# Altium schematic sheet Sheet1.SchDoc
size A4
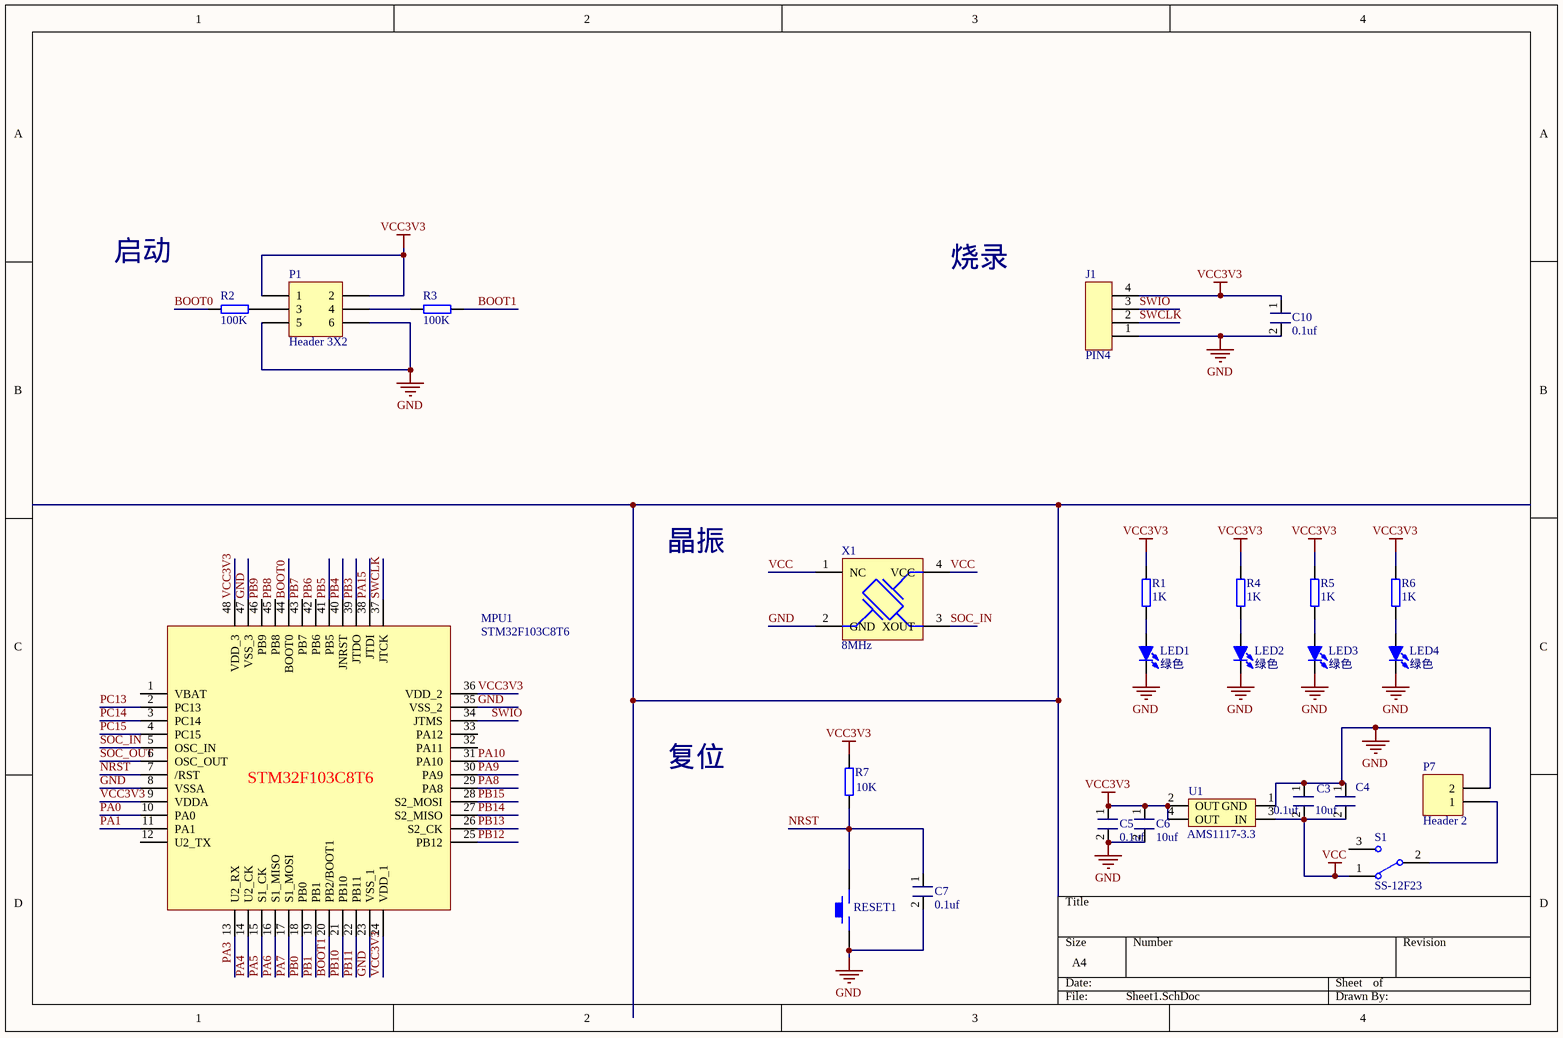
[diagram p0: Sheet1.SchDoc]

## Parts
C3  0.1uf  [0603-C]
C4  10uf  [0603-C]
C5  0.1uf  [0603-C]
C6  10uf  [0603-C]
C7  0.1uf  [0603-C]
C10  0.1uf  [0603-C]
J1  PIN4  [HDR-1X4_H]
LED1  绿色  [LED 0603W]
LED2  绿色  [LED 0603W]
LED3  绿色  [LED 0603W]
LED4  绿色  [LED 0603W]
MPU1  STM32F103C8T6  [stm32f103c8t6]
P1  Header 3X2  [HDR2X3]
P7  Header 2  [TX60PW-F20]
R1  1K  [0603-R]
R2  100K  [0603-R]
R3  100K  [0603-R]
R4  1K  [0603-R]
R5  1K  [0603-R]
R6  1K  [0603-R]
R7  10K  [0603-R]
RESET1  KEY_M  [TSW SMD-6*6*11]  (value not drawn)
S1  SS-12F23  [SS-12D10]
U1  AMS1117-3.3  [AMS1117]
X1  8MHz

## Nets
GND: C3.1 C4.1 C5.2 C6.2 C7.2 C10.2 J1.1 LED1.2(K) LED2.2(K) LED3.2(K) LED4.2(K) MPU1.8(VSSA) MPU1.23(VSS_1) MPU1.35(VSS_2) MPU1.47(VSS_3) P1.5 P1.6 P7.2 RESET1.1 U1.1(GND) X1.2(GND)
VCC: C3.2 C4.2 S1.1 U1.3(IN) X1.1(NC) X1.4(VCC)
VCC3V3: C5.1 C6.1 C10.1 J1.4 MPU1.9(VDDA) MPU1.24(VDD_1) MPU1.36(VDD_2) MPU1.48(VDD_3) P1.1 P1.2 R1.1 R4.1 R5.1 R6.1 R7.2 U1.2(OUT) U1.4(OUT)
BOOT0: MPU1.44(BOOT0) R2.1
BOOT1: MPU1.20(PB2/BOOT1) R3.2
NRST: C7.1 MPU1.7(/RST) R7.1 RESET1.2
PA0: MPU1.10(PA0)
PA1: MPU1.11(PA1)
PA3: MPU1.13(U2_RX)
PA4: MPU1.14(U2_CK)
PA5: MPU1.15(S1_CK)
PA6: MPU1.16(S1_MISO)
PA7: MPU1.17(S1_MOSI)
PA8: MPU1.29(PA8)
PA9: MPU1.30(PA9)
PA10: MPU1.31(PA10)
PA15: MPU1.38(JTDI)
PB0: MPU1.18(PB0)
PB1: MPU1.19(PB1)
PB3: MPU1.39(JTDO)
PB4: MPU1.40(JNRST)
PB5: MPU1.41(PB5)
PB6: MPU1.42(PB6)
PB7: MPU1.43(PB7)
PB8: MPU1.45(PB8)
PB9: MPU1.46(PB9)
PB10: MPU1.21(PB10)
PB11: MPU1.22(PB11)
PB12: MPU1.25(PB12)
PB13: MPU1.26(S2_CK)
PB14: MPU1.27(S2_MISO)
PB15: MPU1.28(S2_MOSI)
PC13: MPU1.2(PC13)
PC14: MPU1.3(PC14)
PC15: MPU1.4(PC15)
SOC_IN: MPU1.5(OSC_IN) X1.3(XOUT)
SOC_OUT: MPU1.6(OSC_OUT)
SWCLK: J1.2 MPU1.37(JTCK)
SWIO: J1.3 MPU1.34(JTMS)
NetLED1_1: LED1.1(A) R1.2
NetLED2_1: LED2.1(A) R4.2
NetLED3_1: LED3.1(A) R5.2
NetLED4_1: LED4.1(A) R6.2
NetP1_3: P1.3 R2.2
NetP1_4: P1.4 R3.1
NetP7_1: P7.1 S1.2

Not connected (* = marked no-connect by the designer): MPU1 1(VBAT) 12(U2_TX) 32(PA11) 33(PA12); S1 3

## Notes on the sheet
- 启动
- 烧录
- 晶振
- 复位

## Library data of the parts
C3-C7 C10 = Cap
LED1-LED4 = LED-SMD: 贴片LED; 版权归属: 黎明电子style; BOM名称: 贴片LED; 学习资源: https://lmdzstyle.taobao.com/
P1 = Header 3X2: Header, 3-Pin, Dual row; LatestRevisionDate: 17-Jul-2002; LatestRevisionNote: Re-released for DXP Platform.; Publisher: Altium Limited
P7 = Header 2: Header, 2-Pin; LatestRevisionDate: 17-Jul-2002; LatestRevisionNote: Re-released for DXP Platform.; Publisher: Altium Limited
R1-R7 = RES-SMD
S1 = SSW-1P: 1路波动开关; BOM名称: 波动开关; 版权归属: 黎明电子style; 学习资源: https://lmdzstyle.taobao.com/
U1 = AMS1117
X1 = CRYSTAL-A